# Altium schematic sheet Screen.SchDoc
size A4
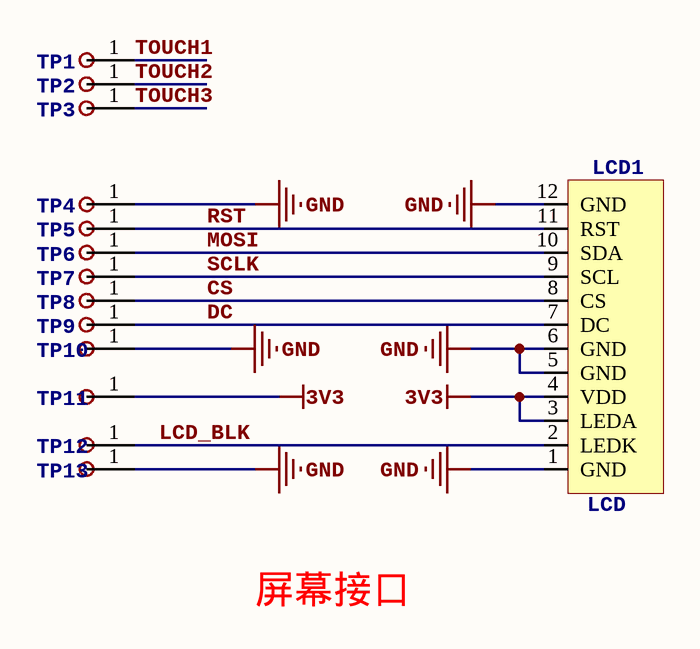
[diagram p0: Screen.SchDoc]

## Parts
LCD  LCD1  [LCD-240x240-ROUND]
TP1  TP  [TP]  (value not drawn)
TP2  TP  [TP]  (value not drawn)
TP3  TP  [TP]  (value not drawn)
TP4  TP  [TP]  (value not drawn)
TP5  TP  [TP]  (value not drawn)
TP6  TP  [TP]  (value not drawn)
TP7  TP  [TP]  (value not drawn)
TP8  TP  [TP]  (value not drawn)
TP9  TP  [TP]  (value not drawn)
TP10  TP  [TP]  (value not drawn)
TP11  TP  [TP]  (value not drawn)
TP12  TP  [TP]  (value not drawn)
TP13  TP  [TP]  (value not drawn)

## Nets
3V3: LCD.3(LEDA) LCD.4(VDD) TP11.1
GND: LCD.1(GND) LCD.5(GND) LCD.6(GND) LCD.12(GND) TP4.1 TP10.1 TP13.1
CS: LCD.8(CS) TP8.1
DC: LCD.7(DC) TP9.1
LCD_BLK: LCD.2(LEDK) TP12.1
MOSI: LCD.10(SDA) TP6.1
RST: LCD.11(RST) TP5.1
SCLK: LCD.9(SCL) TP7.1
TOUCH1: TP1.1
TOUCH2: TP2.1
TOUCH3: TP3.1

## Notes on the sheet
- 屏幕接口

## Library data of the parts
LCD = LCD: 屏幕排线接口
TP1-TP13 = TP: 测试点